# EAGLE design watch_new (EAGLE 9.2.2)
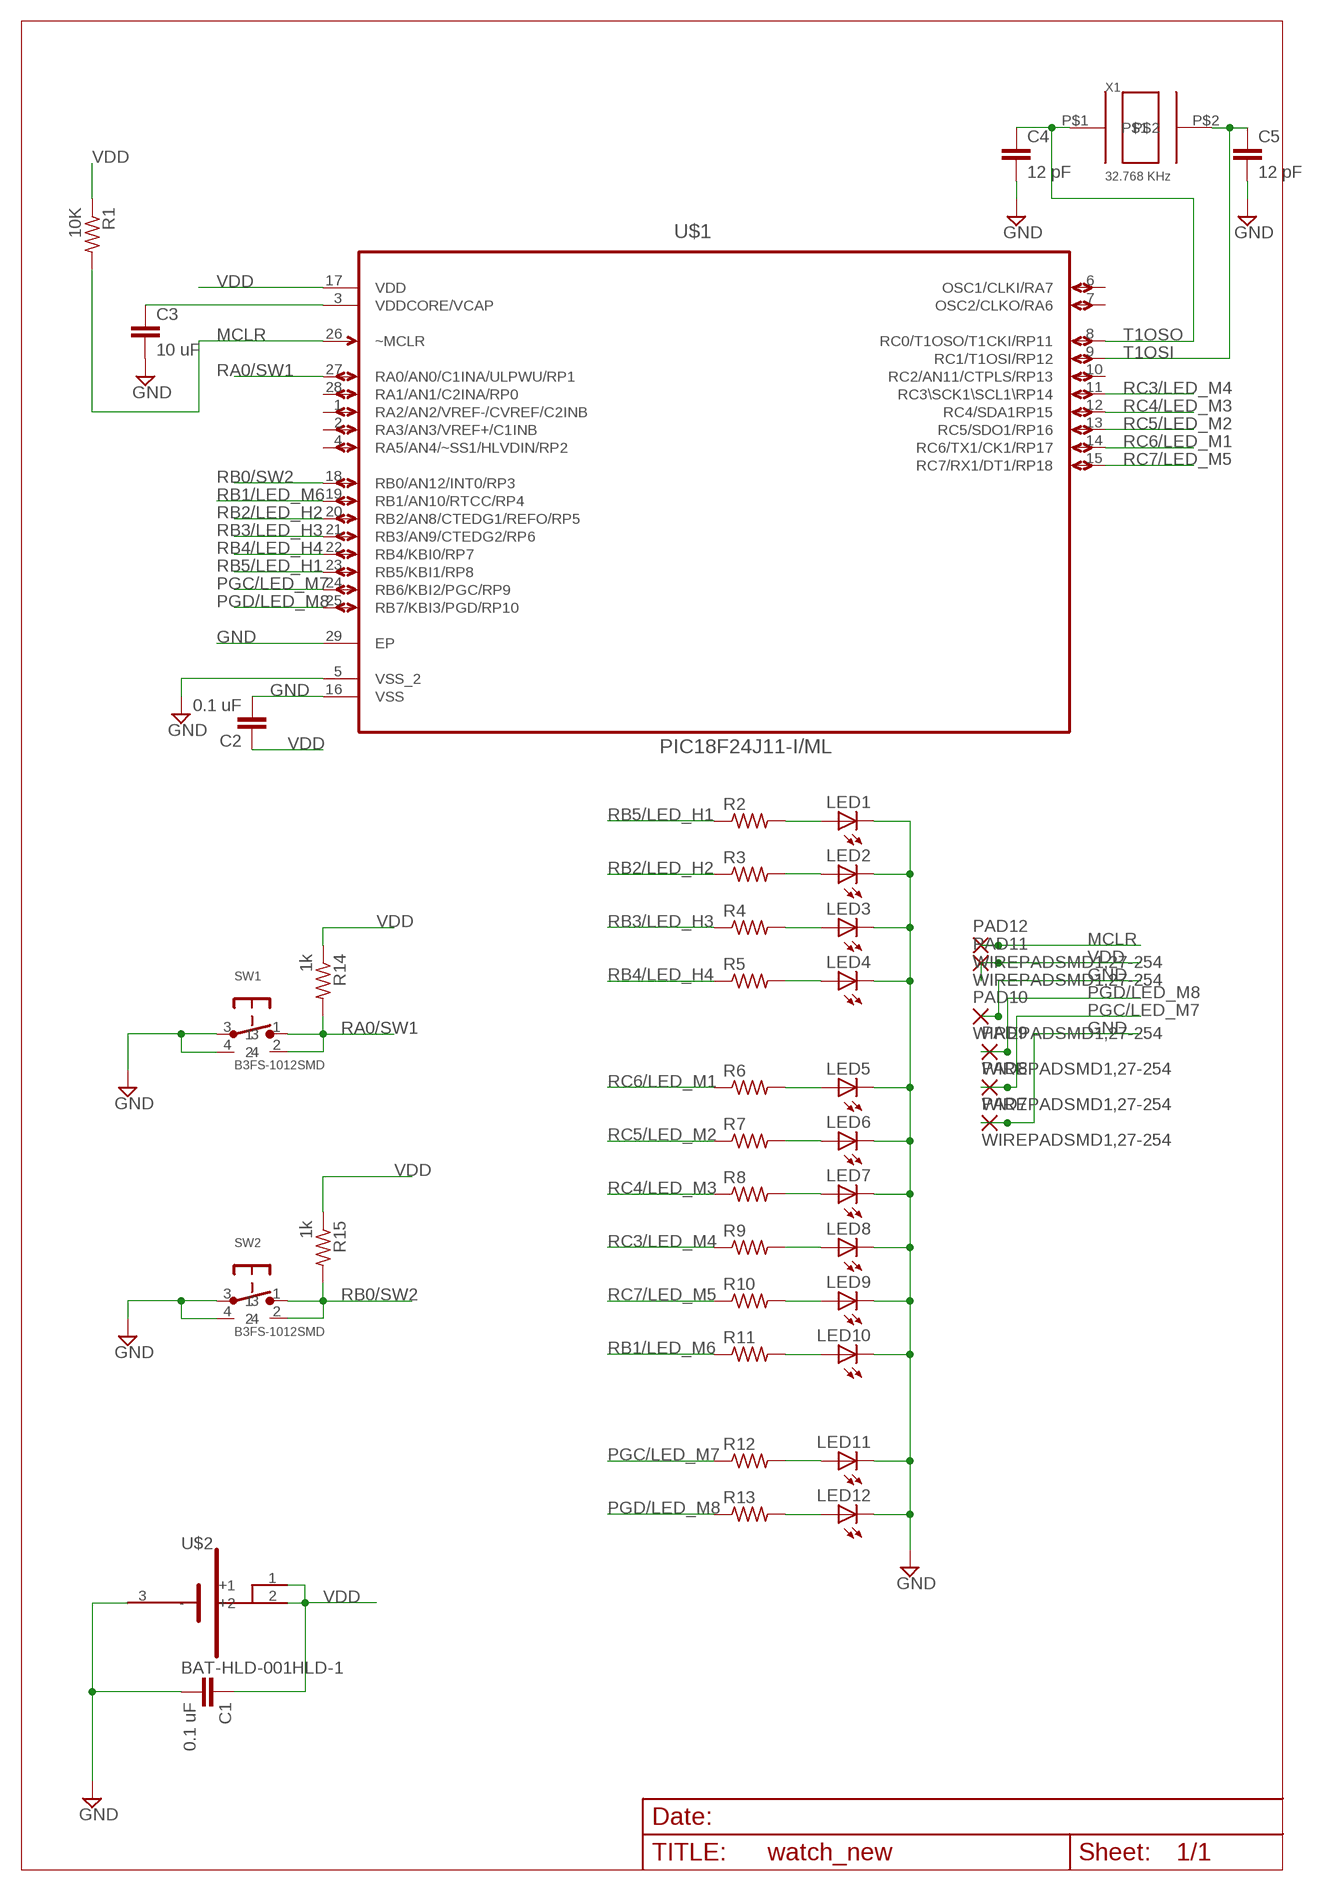
[diagram p0: schematic, sheet 1]

## Parts
C1  0.1 uF  C-EUC0603  [C0603]
C2  0.1 uF  C-EUC0603  [C0603]
C3  10 uF  C-EUC0603  [C0603]
C4  12 pF  C-EUC0603  [C0603]
C5  12 pF  C-EUC0603  [C0603]
LED1  LEDCHIPLED_0603  [CHIPLED_0603]
LED2  LEDCHIPLED_0603  [CHIPLED_0603]
LED3  LEDCHIPLED_0603  [CHIPLED_0603]
LED4  LEDCHIPLED_0603  [CHIPLED_0603]
LED5  LEDCHIPLED_0603  [CHIPLED_0603]
LED6  LEDCHIPLED_0603  [CHIPLED_0603]
LED7  LEDCHIPLED_0603  [CHIPLED_0603]
LED8  LEDCHIPLED_0603  [CHIPLED_0603]
LED9  LEDCHIPLED_0603  [CHIPLED_0603]
LED10  LEDCHIPLED_0603  [CHIPLED_0603]
LED11  LEDCHIPLED_0603  [CHIPLED_0603]
LED12  LEDCHIPLED_0603  [CHIPLED_0603]
PAD7  WIREPADSMD1,27-254  [SMD1,27-2,54]
PAD8  WIREPADSMD1,27-254  [SMD1,27-2,54]
PAD9  WIREPADSMD1,27-254  [SMD1,27-2,54]
PAD10  WIREPADSMD1,27-254  [SMD1,27-2,54]
PAD11  WIREPADSMD1,27-254  [SMD1,27-2,54]
PAD12  WIREPADSMD1,27-254  [SMD1,27-2,54]
R1  10K  R-US_R0603  [R0603]
R2  R-US_R0603  [R0603]
R3  R-US_R0603  [R0603]
R4  R-US_R0603  [R0603]
R5  R-US_R0603  [R0603]
R6  R-US_R0603  [R0603]
R7  R-US_R0603  [R0603]
R8  R-US_R0603  [R0603]
R9  R-US_R0603  [R0603]
R10  R-US_R0603  [R0603]
R11  R-US_R0603  [R0603]
R12  R-US_R0603  [R0603]
R13  R-US_R0603  [R0603]
R14  1k  R-US_R0603  [R0603]
R15  1k  R-US_R0603  [R0603]
SW1  B3FS-1012SMD  [B3FS-1012]
SW2  B3FS-1012SMD  [B3FS-1012]
U$1  PIC18F24J11-I/ML  [QFN65P600X600X100-29N]
U$2  BAT-HLD-001HLD-1  [BAT-HLD-001]
X1  32.768 KHz  ST3215SB32768E0HPWBB  [XTAL_3.2X1.5]

## Nets
GND: C1.2 C2.2 C3.2 C4.2 C5.2 LED1.C LED2.C LED3.C LED4.C LED5.C LED6.C LED7.C LED8.C LED9.C LED10.C LED11.C LED12.C PAD7.1(P) PAD10.1(P) SW1.3 SW1.4 SW2.3 SW2.4 U$1.5(VSS_2) U$1.16(VSS) U$1.29(EP) U$2.3(-)
MCLR: PAD12.1(P) R1.2 U$1.26(~MCLR)
N$2: LED1.A R2.2
N$3: LED2.A R3.2
N$4: C3.1 U$1.3(VDDCORE/VCAP)
N$6: LED3.A R4.2
N$7: LED4.A R5.2
N$8: LED5.A R6.2
N$9: LED6.A R7.2
N$10: LED7.A R8.2
N$11: LED8.A R9.2
N$12: LED9.A R10.2
N$13: LED10.A R11.2
N$14: LED11.A R12.2
N$15: LED12.A R13.2
PGC/LED_M7: PAD8.1(P) R12.1 U$1.24(RB6/KBI2/PGC/RP9)
PGD/LED_M8: PAD9.1(P) R13.1 U$1.25(RB7/KBI3/PGD/RP10)
RA0/SW1: R14.2 SW1.1 SW1.2 U$1.27(RA0/AN0/C1INA/ULPWU/RP1)
RB0/SW2: R15.2 SW2.1 SW2.2 U$1.18(RB0/AN12/INT0/RP3)
RB1/LED_M6: R11.1 U$1.19(RB1/AN10/RTCC/RP4)
RB2/LED_H2: R3.1 U$1.20(RB2/AN8/CTEDG1/REFO/RP5)
RB3/LED_H3: R4.1 U$1.21(RB3/AN9/CTEDG2/RP6)
RB4/LED_H4: R5.1 U$1.22(RB4/KBI0/RP7)
RB5/LED_H1: R2.1 U$1.23(RB5/KBI1/RP8)
RC3/LED_M4: R9.1 U$1.11(RC3\SCK1\SCL1\RP14)
RC4/LED_M3: R8.1 U$1.12(RC4/SDA1RP15)
RC5/LED_M2: R7.1 U$1.13(RC5/SDO1/RP16)
RC6/LED_M1: R6.1 U$1.14(RC6/TX1/CK1/RP17)
RC7/LED_M5: R10.1 U$1.15(RC7/RX1/DT1/RP18)
T1OSI: C5.1 U$1.9(RC1/T1OSI/RP12) X1.P$2
T1OSO: C4.1 U$1.8(RC0/T1OSO/T1CKI/RP11) X1.P$1
VDD: C1.1 C2.1 PAD11.1(P) R1.1 R14.1 R15.1 U$1.17(VDD) U$2.1(+1) U$2.2(+2)
Unconnected: U$1.1(RA2/AN2/VREF-/CVREF/C2INB) U$1.2(RA3/AN3/VREF+/C1INB) U$1.4(RA5/AN4/~SS1/HLVDIN/RP2) U$1.6(OSC1/CLKI/RA7) U$1.7(OSC2/CLKO/RA6) U$1.10(RC2/AN11/CTPLS/RP13) U$1.28(RA1/AN1/C2INA/RP0)

## Library data of the parts
C1-C5 = resistor:C-EU: CAPACITOR, European symbol
LED1-LED12 = led:LED: LED OSRAM: - CHIPLED LG R971, LG N971, LY N971, LG Q971, LY Q971, LO R971, LY R971 LH N974, LH R974 LS Q976, LO Q976, LY Q976 LO Q996 - Hyper CHIPLED LW Q18S LB Q993, LB Q99A, LB R99A - SideLED LS A670, LO A670, LY A670, LG A670, LP A670 LB A673, LV A673, LT A673, LW A673 LH A674 LY A675 LS A676, LA A676, LO A676, LY A676, LW A676 LS A679, LY A679, LG A679 - Hyper Micro SIDELED® LS Y876, LA Y876, LO Y876, LY Y876 LT Y87S - SmartLED LW L88C, LW L88S LB L89C, LB L89S, LG L890 LS L89K, LO L89K, LY L89K LS L896, LA L896, LO L896, LY L896 - TOPLED LS T670, LO T670, LY T670, LG T670, LP T670 LSG T670, LSP T670, LSY T670, LOP T670, LYG T670 LG T671, LOG T671, LSG T671 LB T673, LV T673, LT T673, LW T673 LH T674 LS T676, LA T676, LO T676, LY T676, LB T676, LH T676, LSB T676, LW T676 LB T67C, LV T67C, LT T67C, LS T67K, LO T67K, LY T67K, LW E67C LS E67B, LA E67B, LO E67B, LY E67B, LB E67C, LV E67C, LT E67C LW T67C LS T679, LY T679, LG T679 LS T770, LO T770, LY T770, LG T770, LP T770 LB T773, LV T773, LT T773, LW T773 LH T774 LS E675, LA E675, LY E675, LS T675 LS T776, LA T776, LO T776, LY T776, LB T776 LHGB T686 LT T68C, LB T68C - Hyper Mini TOPLED® LB M676 - Mini TOPLED Santana® LG M470 LS M47K, LO M47K, LY M47K Source: http://www.osram.convergy.de LUXEON: - LUMILED® LXK2-PW12-R00, LXK2-PW12-S00, LXK2-PW14-U00, LXK2-PW14-V00 LXK2-PM12-R00, LXK2-PM12-S00, LXK2-PM14-U00 LXK2-PE12-Q00, LXK2-PE12-R00, LXK2-PE12-S00, LXK2-PE14-T00, LXK2-PE14-U00 LXK2-PB12-K00, LXK2-PB12-L00, LXK2-PB12-M00, LXK2-PB14-N00, LXK2-PB14-P00, LXK2-PB14-Q00 LXK2-PR12-L00, LXK2-PR12-M00, LXK2-PR14-Q00, LXK2-PR14-R00 LXK2-PD12-Q00, LXK2-PD12-R00, LXK2-PD12-S00 LXK2-PH12-R00, LXK2-PH12-S00 LXK2-PL12-P00, LXK2-PL12-Q00, LXK2-PL12-R00 Source: www.luxeon.com KINGBRIGHT: KA-3528ASYC Source: www.kingbright.com
PAD7-PAD12 = wirepad:WIREPAD: Wire PAD connect wire on PCB
R1-R15 = resistor:R-US_: RESISTOR, American symbol
SW1 SW2 = pic18f24j11:B3FS-1012
U$1 = pic18f24j11:PIC18F24J11-I/ML: 8BIT MCU; DESCRIPTION: 8BIT MCU; MPN: PIC18F24J11-I/Ml; OC_FARNELL: 1707634; OC_NEWARK: 98M1764; PACKAGE: QFN-28; SUPPLIER: Microchip
U$2 = pic18f24j11:BAT-HLD-001
X1 = xtal:ST3215SB32768E0HPWBB

## Board
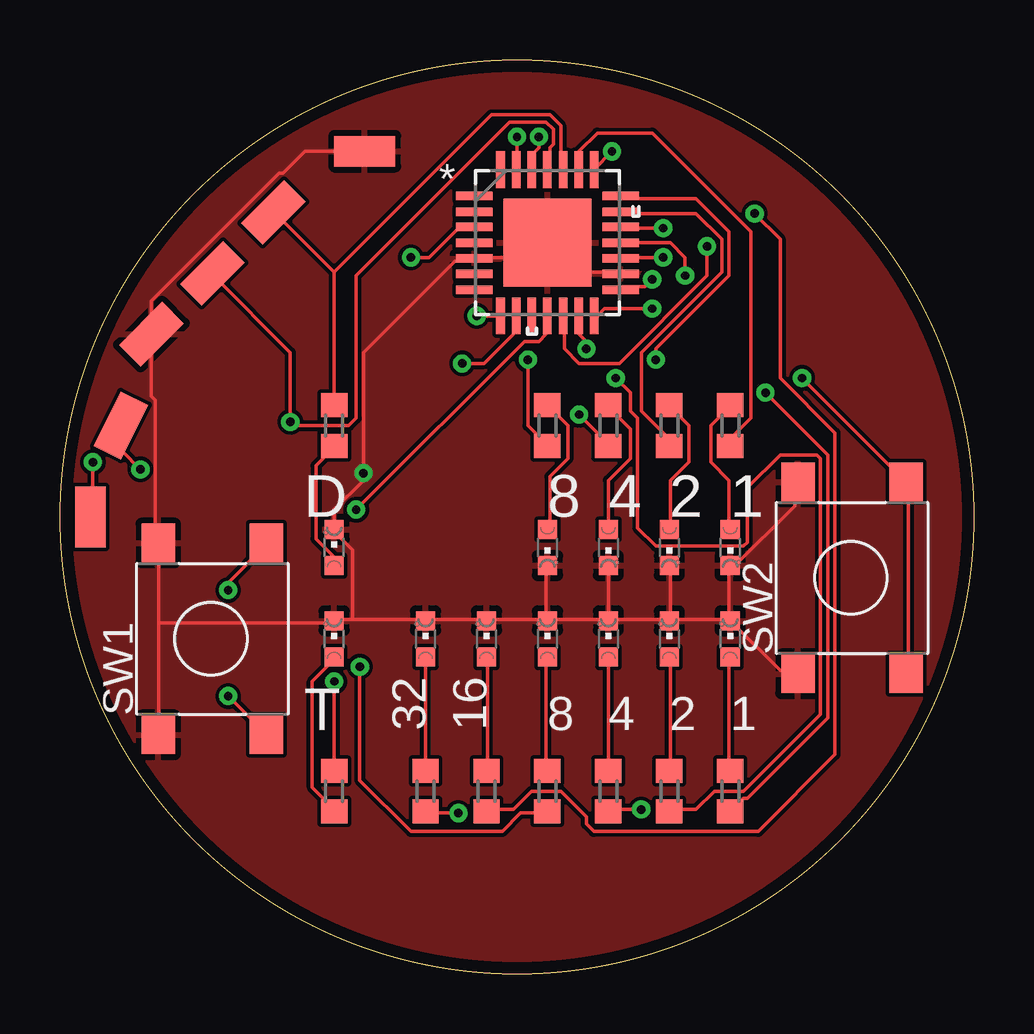
[diagram p1: board, top side]
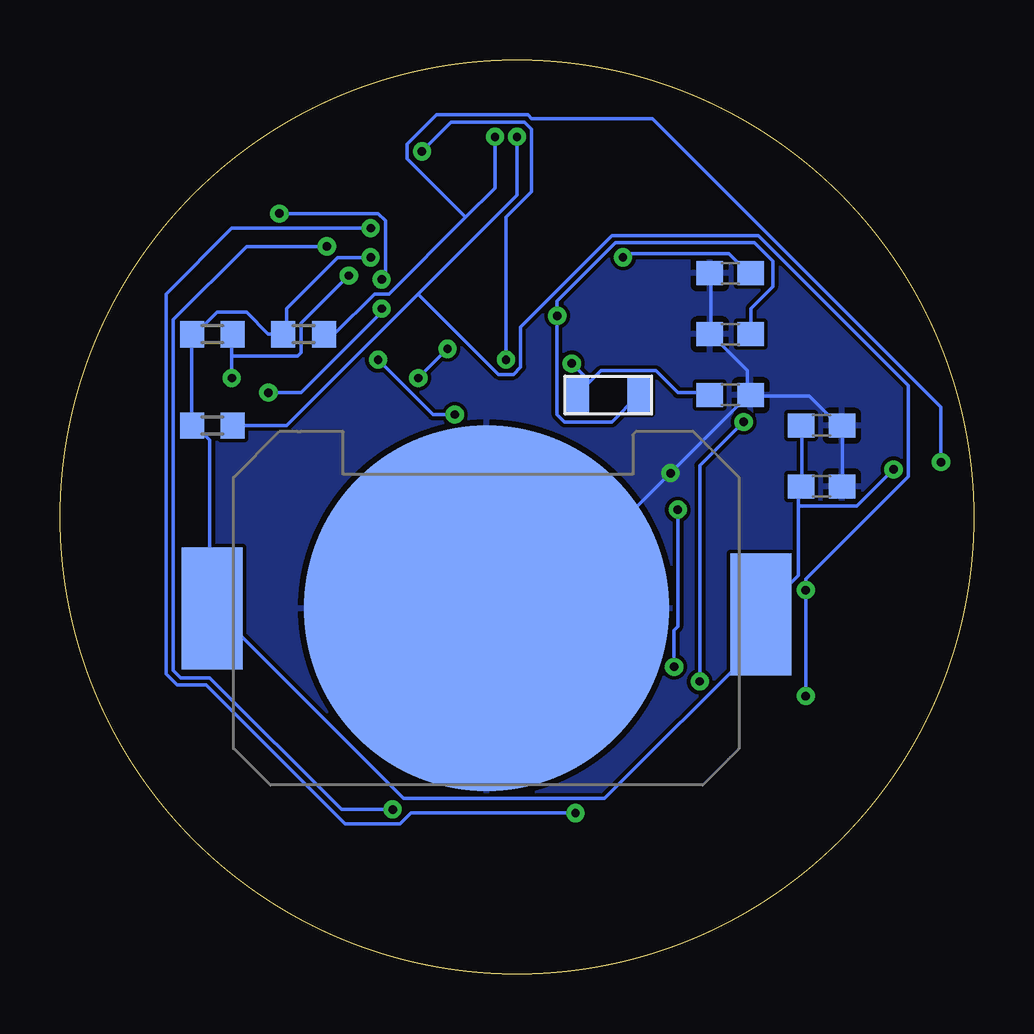
[diagram p2: board, bottom side, seen from below]

Size 38.1 x 38.1 mm. Coordinates in mm from the lower left corner, seen from the top.
Outline: circle at 19.05,19.05 radius 19.05
Copper layers (1*16): Top 0.035mm / dielectric 1.5mm / Bottom 0.035mm
Design rules "default *": minimum track width 6mil, minimum drill 0.35mm, track to track 6mil, track to pad 6mil, pad to pad 6mil, via to via 6mil, smd to smd 6mil, copper to edge 20mil, drill to drill 6mil, minimum pad ring 10mil, minimum via ring 8mil, stop-mask expansion 4mil, vias tented up to drill 0mil, thermal gap 10mil

### Footprints (pad centres in the part's own frame; a part is rotated, then mirrored left to right if it is on the bottom)
C0603 = smd 1.1 x 1: 1 -0.85,0; 2 0.85,0
CHIPLED_0603 = smd 0.8 x 0.8: A 0,-0.75; C 0,0.75
SMD1,27-2,54 = smd 1.27 x 2.54: 1 0,0
R0603 = smd 1 x 1.1: 1 -0.85,0; 2 0.85,0
B3FS-1012 = smd 1.6 x 1.4: 1 4,-2.25; 2 -4,-2.25; 3 4,2.25; 4 -4,2.25
QFN65P600X600X100-29N = smd 1.524 x 0.356: 1 -3.048,1.956; 2 -3.048,1.295; 3 -3.048,0.66; 4 -3.048,0; 5 -3.048,-0.66; 6 -3.048,-1.295; 7 -3.048,-1.956; 15 3.048,-1.956; 16 3.048,-1.295; 17 3.048,-0.66; 18 3.048,0; 19 3.048,0.66; 20 3.048,1.295; 21 3.048,1.956 | smd 0.356 x 1.524: 8 -1.956,-3.048; 9 -1.295,-3.048; 10 -0.66,-3.048; 11 0,-3.048; 12 0.66,-3.048; 13 1.295,-3.048; 14 1.956,-3.048; 22 1.956,3.048; 23 1.295,3.048; 24 0.66,3.048; 25 0,3.048; 26 -0.66,3.048; 27 -1.295,3.048; 28 -1.956,3.048 | smd 3.658 x 3.658: 29 0,0
BAT-HLD-001 = smd 2.54 x 5.08: 1 -11.43,0.254; 2 11.43,0 | smd 15.24 x 15.24: 3 0,0
XTAL_3.2X1.5 = smd 1 x 1.55: P$1 1.3,0; P$2 -1.3,0

### Placement (x,y rotation side)
C1  6.35,22.86 0 bottom
C2  6.35,20.32 0 bottom
C3  10.16,29.21 180 bottom
C4  10.16,26.67 180 bottom
C5  10.16,24.13 0 bottom
LED1  27.94,17.78 180 top
LED2  25.4,17.78 180 top
LED3  22.86,17.78 180 top
LED4  20.32,17.78 180 top
LED5  27.94,13.97 0 top
LED6  25.4,13.97 0 top
LED7  22.86,13.97 0 top
LED8  20.32,13.97 0 top
LED9  17.78,13.97 0 top
LED10  15.24,13.97 0 top
LED11  11.43,17.78 0 top
LED12  11.43,13.97 0 top
PAD7  12.7,34.29 270 top
PAD8  8.89,31.75 315 top
PAD9  6.35,29.21 315 top
PAD10  3.81,26.67 135 top
PAD11  2.54,22.86 153.5 top
PAD12  1.27,19.05 180 top
R1  27.94,26.67 0 bottom
R2  27.94,22.86 90 top
R3  25.4,22.86 90 top
R4  22.86,22.86 90 top
R5  20.32,22.86 90 top
R6  27.94,7.62 90 top
R7  25.4,7.62 90 top
R8  22.86,7.62 90 top
R9  20.32,7.62 90 top
R10  17.78,7.62 90 top
R11  15.24,7.62 90 top
R12  11.43,22.86 270 top
R13  11.43,7.62 270 top
R14  31.75,22.86 0 bottom
R15  31.75,26.67 0 bottom
SW1  6.35,13.97 90 top
SW2  33.02,16.51 90 top
U$1  20.32,30.48 0 top
U$2  20.32,15.24 180 bottom
X1  15.24,24.13 0 bottom

### Tracks (layer width: path | path; a pad name or v marks a point on that pad's centre or on a via)
GND  (via drill 0.35)
  Top 0.152: 4.12,14.63 4.12,17.83 SW1.3 3.96,17.98 3.96,23.93 3.81,24.08 PAD10.1 3.81,28.04 9.14,33.38 9.3,33.38 10.21,34.29 PAD7.1 | 4.12,14.63 4.12,10.06 SW1.4 | U$1.16 23.32,29.26 21.64,29.26 20.42,30.48 U$1.29 20.27,30.48 19.66,29.87 17.37,29.87 U$1.5 17.22,29.72 16.46,29.72 12.65,25.91 v12.65,20.88 12.65,20.57 11.43,19.36 LED11.C 11.43,18.44 12.19,17.68 12.19,14.78 | 15.24,14.78 12.19,14.78 | 12.19,14.78 11.43,14.78 LED12.C 11.43,14.63 4.12,14.63 | LED3.C 22.86,14.78 | 20.27,14.78 17.83,14.78 LED9.C 17.68,14.78 15.24,14.78 | 20.27,14.78 20.27,16.92 LED4.C | 20.27,14.78 LED8.C 20.42,14.78 22.86,14.78 | 25.45,14.78 25.45,16.92 LED2.C | 27.89,14.78 27.89,16.92 LED1.C 28.04,16.92 30.63,19.51 30.63,20.42 SW2.3 | 27.89,14.78 25.45,14.78 | 25.45,14.78 LED6.C 25.3,14.78 22.86,14.78 | 27.89,14.78 LED5.C 28.04,14.63 30.02,12.65 30.63,12.65 SW2.4 | 22.86,14.78 LED7.C | 15.24,14.78 LED10.C
  Bottom 0.152: C2.2 5.49,20.42 5.49,22.86 C1.2 5.64,22.86 6.86,24.08 9.3,24.08 C5.2 | 10.97,26.67 9.45,25.15 9.45,24.23 C5.2 | 10.97,26.67 10.97,29.11 C3.2 | 10.97,26.67 C4.2 | U$2.3 18.29,15.24 v12.65,20.88 9.45,24.08 C5.2
  pour Top: 8.89,-7.62 -26.67,27.94 -26.67,50.8 41.91,50.8 53.34,39.37 53.34,1.27 44.45,-7.62
  pour Bottom: -1.27,34.29 -5.08,38.1 34.29,38.1 45.72,26.67 45.72,0 41.91,-3.81 -1.27,-3.81
MCLR  (via drill 0.35)
  Top 0.152: v19.96,34.9 19.96,34.44 19.66,34.14 U$1.26 | v1.37,21.34 1.37,19.05 PAD12.1
  Bottom 0.152: R1.2 26.67,26.67 24.99,28.35 24.38,28.35 21.18,31.55 | 21.18,31.55 19.96,32.77 v19.96,34.9 | v1.37,21.34 1.37,23.62 13.41,35.66 18.44,35.66 18.59,35.81 22.4,35.81 23.62,34.59 23.62,33.98 21.18,31.55
N$2
  Top 0.152: LED1.A 27.89,18.59 27.89,20.57 27.13,21.34 27.13,22.86 27.89,23.62 R2.2
N$3
  Top 0.152: LED2.A 25.45,18.59 25.45,20.57 26.21,21.34 26.21,22.86 25.45,23.62 R3.2
N$4  (via drill 0.35)
  Top 0.152: v14.63,29.87 15.39,29.87 16.61,31.09 17.22,31.09 U$1.3
  Bottom 0.152: v14.63,29.87 14.48,30.02 10.21,30.02 9.45,29.26 C3.1
N$6
  Top 0.152: LED3.A 22.86,20.57 23.77,21.49 23.77,22.71 22.86,23.62 R4.2
N$7
  Top 0.152: LED4.A 20.42,18.59 20.42,20.73 21.18,21.49 21.18,22.86 20.42,23.62 R5.2
N$8
  Top 0.152: LED5.A 27.89,13.11 27.89,8.53 R6.2
N$9
  Top 0.152: LED6.A 25.45,13.11 25.45,8.53 R7.2
N$10
  Top 0.152: R8.2 LED7.A
N$11
  Top 0.152: LED8.A 20.27,13.11 20.27,8.53 R9.2
N$12
  Top 0.152: LED9.A 17.83,13.11 17.83,8.53 R10.2
N$13
  Top 0.152: R11.2 LED10.A
N$14
  Top 0.152: LED11.A 11.43,17.37 10.67,18.14 10.67,21.18 11.43,21.95 R12.2
N$15
  Top 0.152: LED12.A 11.43,13.11 10.52,12.19 10.52,7.77 11.43,6.86 R13.2
PGC/LED_M7
  Top 0.152: 11.43,29.26 R12.1 | 11.43,29.26 8.99,31.7 PAD8.1 | 11.43,29.26 17.98,35.81 20.42,35.81 20.88,35.36 20.88,33.53 U$1.24
PGD/LED_M8  (via drill 0.35)
  Top 0.152: v11.43,12.19 R13.1 | PAD9.1 6.4,29.11 9.6,25.91 v9.6,23.01 9.75,22.86 12.04,22.86 12.34,23.17 12.34,29.11 18.75,35.51 20.27,35.51 20.57,35.2 20.57,34.59 20.42,34.44 20.42,33.53 U$1.25
  Bottom 0.152: v11.43,12.19 11.43,21.18 v9.6,23.01
RA0/SW1  (via drill 0.35)
  Top 0.152: v7.01,11.58 8.53,10.06 SW1.2 | v7.01,16 7.01,16.31 8.53,17.83 SW1.1 | v19.05,34.9 19.05,33.53 U$1.27
  Bottom 0.152: v7.01,11.58 v7.01,16 7.01,16.46 2.74,20.73 2.74,24.54 8.99,30.79 15.09,30.79 18.9,26.98 18.9,25.3 19.2,24.99 19.81,24.99 23.16,28.35 | R14.2 28.65,22.86 23.16,28.35 | 23.16,28.35 19.05,32.46 v19.05,34.9
RB0/SW2  (via drill 0.35)
  Top 0.152: v30.94,24.84 35.2,20.57 SW2.1 35.36,20.42 35.36,12.65 SW2.2 | U$1.18 25.45,30.48 26.06,29.87 v26.06,29.11
  Bottom 0.152: v30.94,24.84 30.94,25.76 | 30.94,25.76 30.94,26.67 R15.2 | v26.06,29.11 28.04,27.13 28.04,25.91 28.19,25.76 30.94,25.76
RB1/LED_M6  (via drill 0.35)
  Top 0.152: v16.61,6.71 15.24,6.71 R11.1 | v25.15,31.09 23.47,31.09 U$1.19
  Bottom 0.152: v16.61,6.71 23.47,6.71 23.93,6.25 26.21,6.25 32,12.04 33.22,12.04 33.68,12.5 33.68,28.35 30.94,31.09 v25.15,31.09
RB2/LED_H2
  Top 0.152: R3.1 25.3,22.1 25.3,22.4 24.23,23.47 24.23,25.91 27.58,29.26 27.58,30.63 26.52,31.7 23.47,31.7 U$1.20
RB3/LED_H3  (via drill 0.35)
  Top 0.152: v21.64,23.32 22.86,22.1 R4.1 | v24.84,25.6 24.84,26.06 27.89,29.11 27.89,30.94 26.52,32.31 23.47,32.31 U$1.21
  Bottom 0.152: v21.64,23.32 22.55,23.32 v24.84,25.6
RB4/LED_H4  (via drill 0.35)
  Top 0.152: v19.51,25.6 19.51,22.86 20.27,22.1 R5.1 | v23.01,34.29 22.25,33.53 U$1.22
  Bottom 0.152: v19.51,25.6 19.51,31.55 18.44,32.61 18.44,35.2 18.75,35.51 21.79,35.51 v23.01,34.29
RB5/LED_H1
  Top 0.152: R2.1 28.04,22.1 28.04,22.4 28.8,23.17 28.8,30.94 24.69,35.05 22.4,35.05 21.64,34.29 21.64,33.53 U$1.23
RC3/LED_M4  (via drill 0.35)
  Top 0.152: v12.5,12.8 12.5,8.08 14.63,5.94 18.44,5.94 19.2,6.71 20.27,6.71 R9.1 | v12.34,19.36 19.36,26.37 19.96,26.37 20.27,26.67 20.27,27.43 U$1.11
  Bottom 0.152: v12.5,12.8 12.5,14.33 12.34,14.48 v12.34,19.36
RC4/LED_M3  (via drill 0.35)
  Top 0.152: v24.23,6.86 22.86,6.86 R8.1 | v26.98,30.33 26.98,29.11 23.32,25.45 21.64,25.45 21.03,26.06 21.03,27.43 U$1.12
  Bottom 0.152: v24.23,6.86 26.36,6.86 31.85,12.34 33.07,12.34 33.38,12.65 33.38,27.28 30.33,30.33 v26.98,30.33
RC5/LED_M2  (via drill 0.35)
  Top 0.152: v23.16,24.84 23.77,24.23 23.77,23.47 24.08,23.17 24.08,18.59 24.84,17.83 28.5,17.83 28.65,17.98 28.65,20.27 30.02,21.64 31.55,21.64 31.7,21.49 31.7,10.82 28.5,7.62 27.28,7.62 26.52,6.86 25.45,6.86 R7.1 | v21.95,26.06 21.95,26.37 21.64,26.67 21.64,27.43 U$1.13
  Bottom 0.152: v21.95,26.06 v23.16,24.84
RC6/LED_M1  (via drill 0.35)
  Top 0.152: v29.41,24.23 32,21.64 32,10.67 28.65,7.32 28.5,7.32 28.04,6.86 R6.1 | v24.69,27.74 22.71,27.74 22.4,27.43 U$1.14
  Bottom 0.152: v29.41,24.23 28.04,24.23 24.69,27.58 v24.69,27.74
RC7/LED_M5  (via drill 0.35)
  Top 0.152: v28.96,31.7 30.02,30.63 30.02,24.84 32.31,22.56 32.31,9.14 29.11,5.94 22.25,5.94 21.95,6.25 21.95,6.55 20.88,7.62 19.66,7.62 18.9,6.86 17.83,6.86 R10.1 | v24.69,28.96 24.38,28.65 23.47,28.65 U$1.15
  Bottom 0.152: v28.96,31.7 24.84,31.7 24.54,31.39 24.54,29.11 v24.69,28.96
T1OSI  (via drill 0.35)
  Top 0.152: v16.76,25.45 17.68,25.45 18.9,26.67 18.9,27.43 U$1.9
  Bottom 0.152: 16,24.69 16.46,24.23 X1.P$2 | 16,24.69 15.54,25.15 13.26,25.15 12.34,24.23 11.12,24.23 C5.1 | 16,24.69 v16.76,25.45
T1OSO  (via drill 0.35)
  Top 0.152: v17.37,27.43 U$1.8
  Bottom 0.152: C4.1 9.3,26.67 9.3,27.74 8.38,28.65 8.38,29.72 9.14,30.48 14.94,30.48 17.37,28.04 v17.37,27.43 17.37,23.32 17.07,23.01 15.09,23.01 14.02,24.08 X1.P$1
VDD  (via drill 0.35)
  Top 0.152: v3.35,21.03 2.59,21.79 2.59,22.86 PAD11.1 | v25.15,29.87 23.47,29.87 U$1.17
  Bottom 0.152: C1.1 7.16,22.86 7.16,20.42 C2.1 7.32,20.27 7.32,19.51 | 7.32,19.51 7.32,16.61 8.84,15.09 U$2.1 8.99,14.94 8.99,13.72 15.39,7.32 23.77,7.32 31.7,15.24 U$2.2 31.85,15.24 31.85,22.25 32.46,22.86 R14.1 32.61,22.86 32.61,26.67 R15.1 32.46,26.67 31.55,27.58 30.33,27.58 29.41,26.67 R1.1 28.65,26.67 28.65,27.74 26.52,29.87 v25.15,29.87 | v3.35,21.03 4.88,19.51 7.32,19.51

### Text on the board
tNames: D | 8 | 4 | 2 | 1 | T | 32 | 16 | 8 | 4 | 2 | 1